# EAGLE schematic us_beacon_base_v3rf (EAGLE 6.5.0)

## Sheet 1 of 6
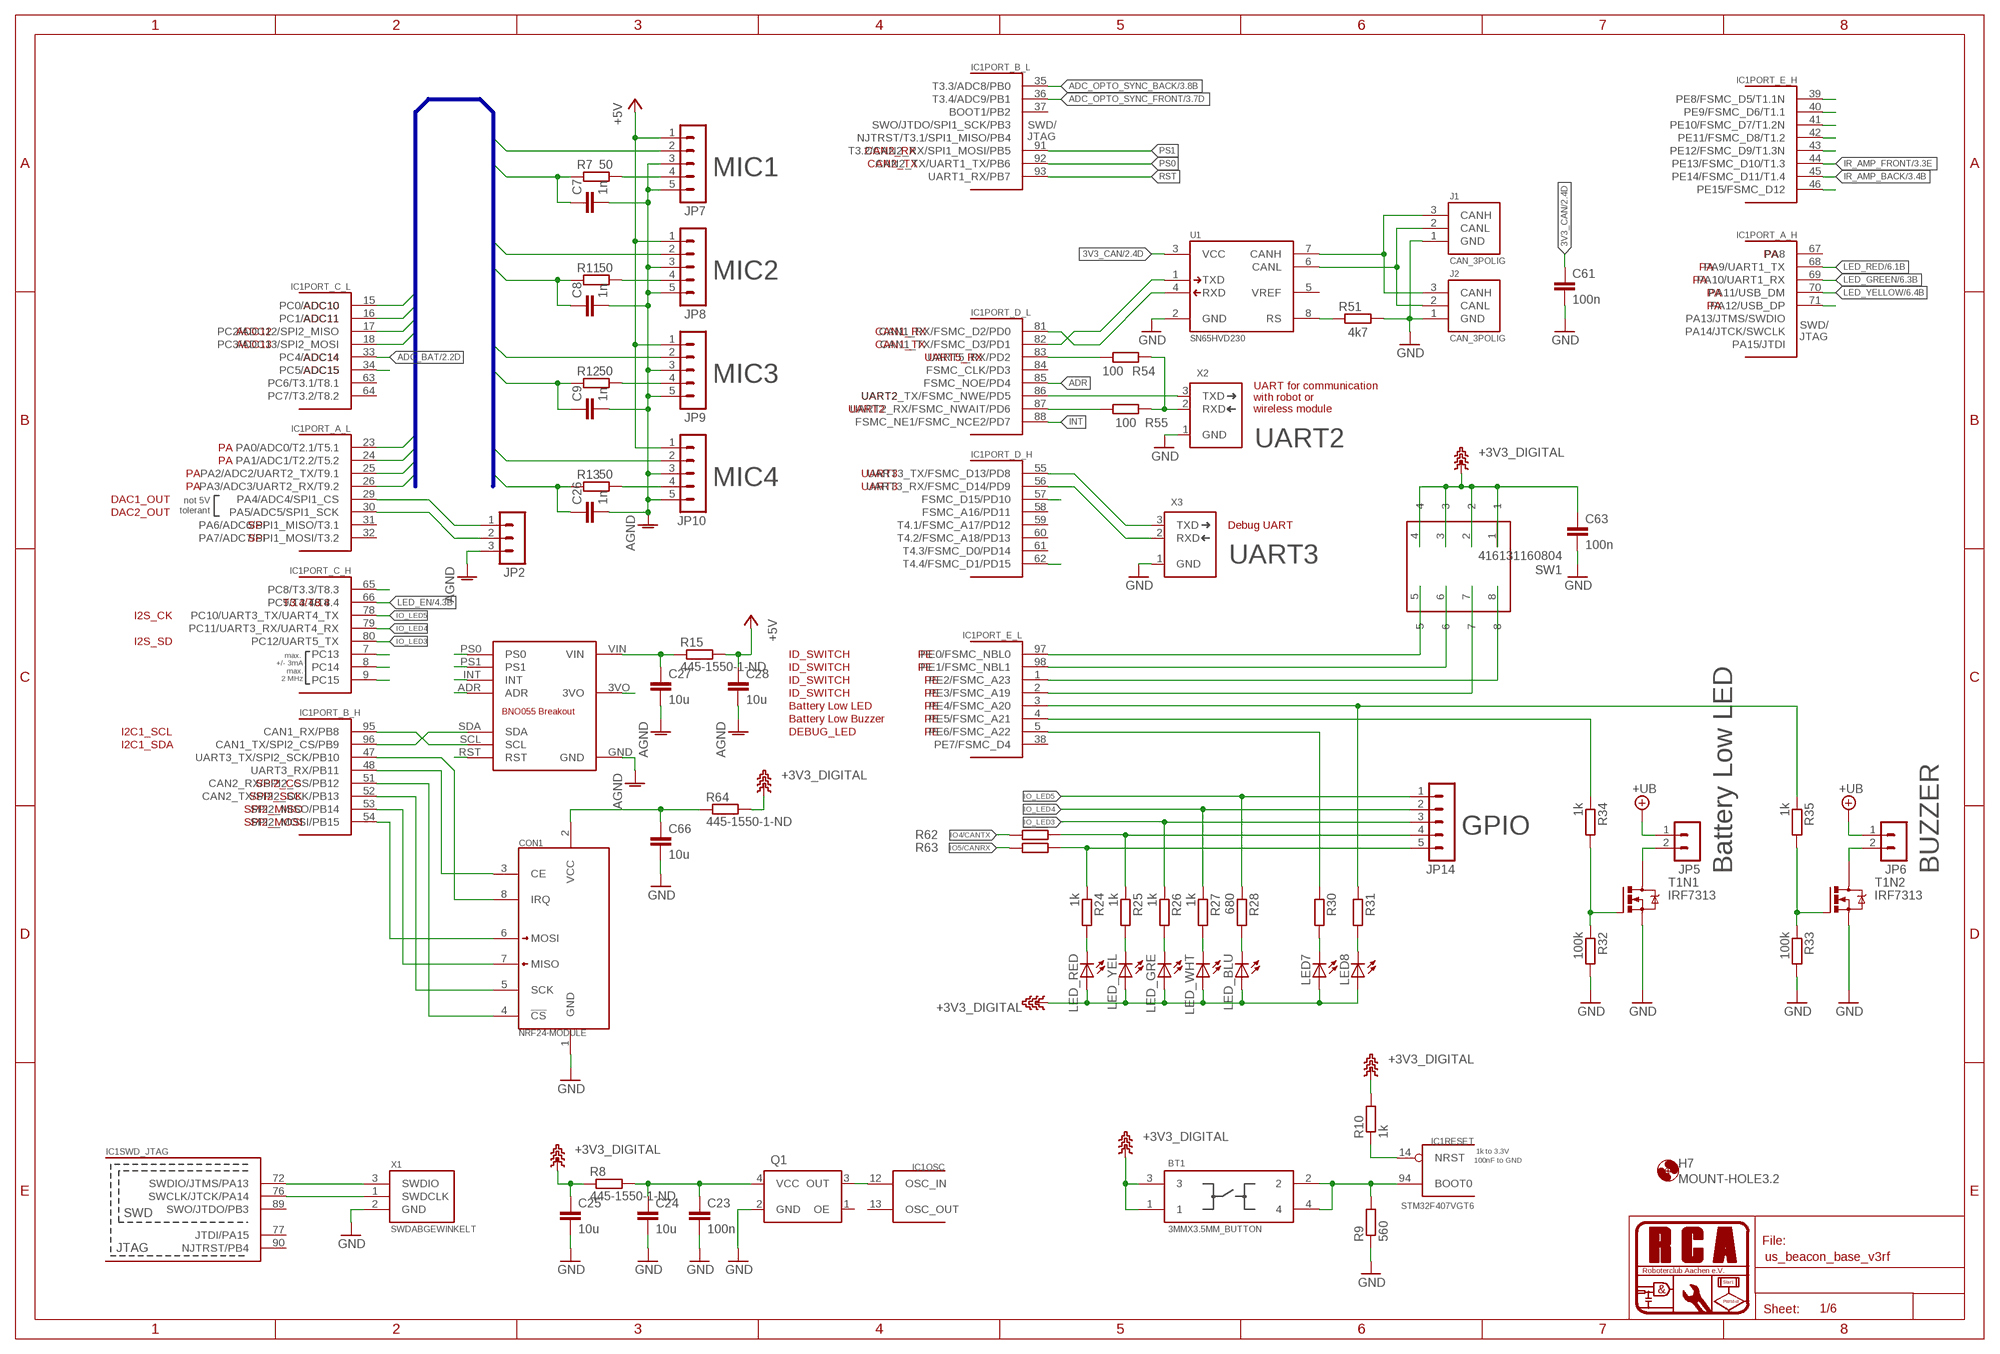
[diagram p0: schematic, sheet 1]

### Parts
BT1  3MMX3.5MM_BUTTON  [3MMX3.5MM_BUTTON]
C7  1n  C-EUC0603  [C0603]
C8  1n  C-EUC0603  [C0603]
C9  1n  C-EUC0603  [C0603]
C23  100n  C-EUC0603  [C0603]
C24  10u  C-EUC0805  [C0805]
C25  10u  C-EUC0805  [C0805]
C26  1n  C-EUC0603  [C0603]
C27  10u  C-EUC0805  [C0805]
C28  10u  C-EUC0805  [C0805]
C61  100n  C-EUC0603  [C0603]
C63  100n  C-EUC0603  [C0603]
C66  10u  C-EUC0805  [C0805]
CON1  NRF24-MODULE  [NRF24-MODULE]
H7  MOUNT-HOLE3.2  [3,2]
IC1  STM32F407VGT6  [TQFP100]
J1  CAN_3POLIG  [7395-03]
J2  CAN_3POLIG  [7395-03]
JP2  PSS_3G  [22-23-2031]
JP5  PSS_2G  [22-23-2021]
JP6  PSS_2G  [22-23-2021]
JP7  PSS_5G  [22-23-2051]
JP8  PSS_5G  [22-23-2051]
JP9  PSS_5G  [22-23-2051]
JP10  PSS_5G  [22-23-2051]
JP14  PSS_5G  [22-23-2051]
LED7  LEDCHIP-LED0603  [CHIP-LED0603]
LED8  LEDCHIP-LED0603  [CHIP-LED0603]
LED_BLU  LEDCHIP-LED0603  [CHIP-LED0603]
LED_GRE  LEDCHIP-LED0603  [CHIP-LED0603]
LED_RED  LEDCHIP-LED0603  [CHIP-LED0603]
LED_WHT  LEDCHIP-LED0603  [CHIP-LED0603]
LED_YEL  LEDCHIP-LED0603  [CHIP-LED0603]
Q1  XO53  [XO53]
R7  50  R-EU_R0603  [R0603]
R8  445-1550-1-ND  R-EU_R0603  [R0603]
R9  560  R-EU_R0603  [R0603]
R10  1k  R-EU_R0603  [R0603]
R11  50  R-EU_R0603  [R0603]
R12  50  R-EU_R0603  [R0603]
R13  50  R-EU_R0603  [R0603]
R15  445-1550-1-ND  R-EU_R0603  [R0603]
R24  1k  R-EU_R0603  [R0603]
R25  1k  R-EU_R0603  [R0603]
R26  1k  R-EU_R0603  [R0603]
R27  1k  R-EU_R0603  [R0603]
R28  680  R-EU_R0603  [R0603]
R30  R-EU_R0603  [R0603]
R31  R-EU_R0603  [R0603]
R32  100k  R-EU_R0603  [R0603]
R33  100k  R-EU_R0603  [R0603]
R34  1k  R-EU_R0603  [R0603]
R35  1k  R-EU_R0603  [R0603]
R51  4k7  R-EU_R0603  [R0603]
R54  100  R-EU_R0603  [R0603]
R55  100  R-EU_R0603  [R0603]
R62  R-EU_R0603  [R0603]
R63  R-EU_R0603  [R0603]
R64  445-1550-1-ND  R-EU_R0603  [R0603]
SW1  416131160804  [416131160804]
T1  IRF7313  IRF7341  [SO08]
U1  SN65HVD230  [SOIC-8]
U$1  BNO055_ADAFRUIT_BREAKOUT  [BNO055_BREAKOUT]
X1  SWDABGEWINKELT  [7395-03]
X2  SERIAL_DEBUG_3PINL  [7395-03]
X3  SERIAL_DEBUG_3PINL  [7395-03]

### Nets
3V3_CAN: C61.1 U1.3(VCC) ; also sheet 2
+3V3_DIGITAL: BT1.1 BT1.3 C25.1 C63.1 LED7.A LED8.A LED_BLU.A LED_GRE.A LED_RED.A LED_WHT.A LED_YEL.A R8.1 R10.2 R64.2 SW1.1 SW1.2 SW1.3 SW1.4 ; also sheet 2
+5V: C28.1 JP7.1 JP8.1 JP9.1 JP10.1 R15.2 ; also sheet 2
+UB: JP5.1 JP6.1 ; also sheet 2,4,6
ADC_BAT: IC1.33(PORT_C_L:PC4/ADC14) ; also sheet 2
ADC_OPTO_SYNC_BACK: IC1.35(PORT_B_L:T3.3/ADC8/PB0) ; also sheet 3
ADC_OPTO_SYNC_FRONT: IC1.36(PORT_B_L:T3.4/ADC9/PB1) ; also sheet 3
ADR: IC1.85(PORT_D_L:FSMC_NOE/PD4) U$1.ADR
AMP1: IC1.23(PORT_A_L:PA0/ADC0/T2.1/T5.1) JP7.2
AMP2: IC1.24(PORT_A_L:PA1/ADC1/T2.2/T5.2) JP8.2
AMP3: IC1.25(PORT_A_L:PA2/ADC2/UART2_TX/T9.1) JP9.2
AMP4: IC1.26(PORT_A_L:PA3/ADC3/UART2_RX/T9.2) JP10.2
DAC1/I2S1_WS: IC1.29(PORT_A_L:PA4/ADC4/SPI1_CS) JP2.1
DAC2/SPI1_SCK: IC1.30(PORT_A_L:PA5/ADC5/SPI1_SCK) JP2.2
GND: C7.2 C8.2 C9.2 C23.2 C24.2 C25.2 C26.2 C27.2 C28.2 C61.2 C63.2 C66.2 CON1.1(GND) J1.1(GND) J2.1(GND) JP2.3 JP7.3 JP7.5 JP8.3 JP8.5 JP9.3 JP9.5 JP10.3 JP10.5 Q1.2(GND) R9.1 R32.2 R33.2 R51.2 T1.1(N1:S) T1.3(N2:S) U1.2(GND) U$1.GND X1.2(GND) X2.1(GND) X3.1(GND) ; supply symbol labelled AGND ; also sheet 2,3,4,6
INT: IC1.88(PORT_D_L:FSMC_NE1/FSMC_NCE2/PD7) U$1.INT
IO4: JP14.4 R25.1 R62.2
IO4/CANTX: IC1.82(PORT_D_L:CAN1_TX/FSMC_D3/PD1) R62.1 U1.1(TXD)
IO5: JP14.5 R24.1 R63.2
IO5/CANRX: IC1.81(PORT_D_L:CAN1_RX/FSMC_D2/PD0) R63.1 U1.4(RXD)
IO_LED3: IC1.80(PORT_C_H:PC12/UART5_TX) JP14.3 R26.1
IO_LED4: IC1.79(PORT_C_H:PC11/UART3_RX/UART4_RX) JP14.2 R27.1
IO_LED5: IC1.78(PORT_C_H:PC10/UART3_TX/UART4_TX) JP14.1 R28.1
IR_AMP_BACK: IC1.45(PORT_E_H:PE14/FSMC_D11/T1.4) ; also sheet 3
IR_AMP_FRONT: IC1.44(PORT_E_H:PE13/FSMC_D10/T1.3) ; also sheet 3
LED_EN: IC1.66(PORT_C_H:PC9/T3.4/T8.4) ; also sheet 4
LED_GREEN: IC1.69(PORT_A_H:PA10/UART1_RX) ; also sheet 6
LED_RED: IC1.68(PORT_A_H:PA9/UART1_TX) ; also sheet 6
LED_YELLOW: IC1.70(PORT_A_H:PA11/USB_DM) ; also sheet 6
MIC1: C7.1 IC1.15(PORT_C_L:PC0/ADC10) R7.1
MIC2: C8.1 IC1.16(PORT_C_L:PC1/ADC11) R11.1
MIC3: C9.1 IC1.17(PORT_C_L:PC2/ADC12/SPI2_MISO) R12.1
MIC4: C26.1 IC1.18(PORT_C_L:PC3/ADC13/SPI2_MOSI) R13.1
N$1: IC1.72(SWD_JTAG:SWDIO/JTMS/PA13) X1.3(SWDIO)
N$2: IC1.76(SWD_JTAG:SWCLK/JTCK/PA14) X1.1(SWDCLK)
N$5: IC1.57(PORT_D_H:FSMC_D15/PD10)
N$13: JP7.4 R7.2
N$15: IC1.12(OSC:OSC_IN) Q1.3(OUT)
N$16: C23.1 C24.1 Q1.4(VCC) R8.2
N$17: JP9.4 R12.2
N$18: IC1.62(PORT_D_H:T4.4/FSMC_D1/PD15)
N$19: IC1.14(RESET:NRST) R10.1
N$20: JP8.4 R11.2
N$21: JP10.4 R13.2
N$22: BT1.2 BT1.4 IC1.94(RESET:BOOT0) R9.2
N$23: IC1.83(PORT_D_L:UART5_RX/PD2) R54.1
N$24: IC1.39(PORT_E_H:PE8/FSMC_D5/T1.1N)
N$25: IC1.65(PORT_C_H:PC8/T3.3/T8.3)
N$29: C27.1 R15.1 U$1.VIN
N$30: U$1.3VO
N$31: R54.2 R55.2 X2.2(RXD)
N$34: IC1.7(PORT_C_H:PC13)
N$35: IC1.8(PORT_C_H:PC14)
N$36: IC1.9(PORT_C_H:PC15)
N$37: IC1.71(PORT_A_H:PA12/USB_DP)
N$46: IC1.46(PORT_E_H:PE15/FSMC_D12)
N$48: IC1.95(PORT_B_H:CAN1_RX/PB8) U$1.SCL
N$49: IC1.96(PORT_B_H:CAN1_TX/SPI2_CS/PB9) U$1.SDA
N$51: IC1.43(PORT_E_H:PE12/FSMC_D9/T1.3N)
N$52: IC1.42(PORT_E_H:PE11/FSMC_D8/T1.2)
N$53: IC1.41(PORT_E_H:PE10/FSMC_D7/T1.2N)
N$54: IC1.40(PORT_E_H:PE9/FSMC_D6/T1.1)
N$64: IC1.86(PORT_D_L:UART2_TX/FSMC_NWE/PD5) X2.3(TXD)
N$65: IC1.87(PORT_D_L:UART2_RX/FSMC_NWAIT/PD6) R55.1
N$66: IC1.55(PORT_D_H:UART3_TX/FSMC_D13/PD8) X3.3(TXD)
N$67: IC1.56(PORT_D_H:UART3_RX/FSMC_D14/PD9) X3.2(RXD)
N$73: LED_RED.C R24.2
N$74: LED_YEL.C R25.2
N$75: LED_GRE.C R26.2
N$76: LED_WHT.C R27.2
N$77: LED_BLU.C R28.2
N$78: LED7.C R30.2
N$79: LED8.C R31.2
N$80: IC1.3(PORT_E_L:PE4/FSMC_A20) R31.1 R35.1
N$82: IC1.5(PORT_E_L:PE6/FSMC_A22) R30.1
N$84: R32.1 R34.2 T1.2(N1:G)
N$85: R33.1 R35.2 T1.4(N2:G)
N$86: JP5.2 T1.7(N1:D)
N$87: IC1.4(PORT_E_L:PE5/FSMC_A21) R34.1
N$89: JP6.2 T1.5(N2:D)
N$90: IC1.2(PORT_E_L:PE3/FSMC_A19) SW1.7
N$92: IC1.34(PORT_C_L:PC5/ADC15)
N$95: IC1.97(PORT_E_L:PE0/FSMC_NBL0) SW1.5
N$96: IC1.98(PORT_E_L:PE1/FSMC_NBL1) SW1.6
N$98: IC1.1(PORT_E_L:PE2/FSMC_A23) SW1.8
N$102: R51.1 U1.8(RS)
N$103: J1.3(CANH) J2.3(CANH) U1.7(CANH)
N$104: J1.2(CANL) J2.2(CANL) U1.6(CANL)
N$116: CON1.4(!CS) IC1.51(PORT_B_H:CAN2_RX/SPI2_CS/PB12)
N$117: CON1.5(SCK) IC1.52(PORT_B_H:CAN2_TX/SPI2_SCK/PB13)
N$118: CON1.7(MISO) IC1.53(PORT_B_H:SPI2_MISO/PB14)
N$119: CON1.6(MOSI) IC1.54(PORT_B_H:SPI2_MOSI/PB15)
N$127: CON1.3(CE) IC1.48(PORT_B_H:UART3_RX/PB11)
N$128: CON1.8(IRQ) IC1.47(PORT_B_H:UART3_TX/SPI2_SCK/PB10)
N$129: C66.1 CON1.2(VCC) R64.1
PS0: IC1.92(PORT_B_L:CAN2_TX/UART1_TX/PB6) U$1.PS0
PS1: IC1.91(PORT_B_L:T3.2/CAN2_RX/SPI1_MOSI/PB5) U$1.PS1
RST: IC1.93(PORT_B_L:UART1_RX/PB7) U$1.RST
Unconnected: IC1.13(OSC:OSC_OUT) IC1.31(PORT_A_L:PA6/ADC6/SPI1_MISO/T3.1) IC1.32(PORT_A_L:PA7/ADC7/SPI1_MOSI/T3.2) IC1.37(PORT_B_L:BOOT1/PB2) IC1.38(PORT_E_L:PE7/FSMC_D4) IC1.58(PORT_D_H:FSMC_A16/PD11) IC1.59(PORT_D_H:T4.1/FSMC_A17/PD12) IC1.60(PORT_D_H:T4.2/FSMC_A18/PD13) IC1.61(PORT_D_H:T4.3/FSMC_D0/PD14) IC1.63(PORT_C_L:PC6/T3.1/T8.1) IC1.64(PORT_C_L:PC7/T3.2/T8.2) IC1.67(PORT_A_H:PA8) IC1.77(SWD_JTAG:JTDI/PA15) IC1.84(PORT_D_L:FSMC_CLK/PD3) IC1.89(SWD_JTAG:SWO/JTDO/PB3) IC1.90(SWD_JTAG:NJTRST/PB4) Q1.1(OE) T1.6(N2:D1) T1.8(N1:D1) U1.5(VREF)

### Buses
ANALOG_MIC:MIC1,MIC2,MIC3,MIC4,AMP1,AMP2,AMP3,AMP4

### Notes on the sheet
- CAN2_RX
- CAN2_TX
- MIC1
- PA
- PA
- MIC2
- PA
- PA
- ADC10 | PA
- ADC11
- ADC12 | CAN1_RX
- ADC13 | CAN1_TX
- ADC14 | UART5_RX
- ADC15
- MIC3
- UART2
- UART2
- UART for communication 
  with robot or 
  wireless module
- UART2
- PA
- PA
- PA | UART3
- MIC4
- PA | UART3
- DAC1_OUT
- DAC2_OUT
- SPI | Debug UART
- SPI
- UART3
- T3.4/T8.4
- I2S_CK
- I2S_SD
- ID_SWITCH | PE
- ID_SWITCH | PE
- ID_SWITCH | PE
- ID_SWITCH | PE
- Battery Low LED | PE
- Battery Low Buzzer | PE
- I2C1_SCL | DEBUG_LED | PE
- I2C1_SDA
- SPI2_CS
- SPI2_SCK
- SPI2_MISO
- SPI2_MOSI
- GPIO
- Battery Low LED | BUZZER

## Sheet 2 of 6
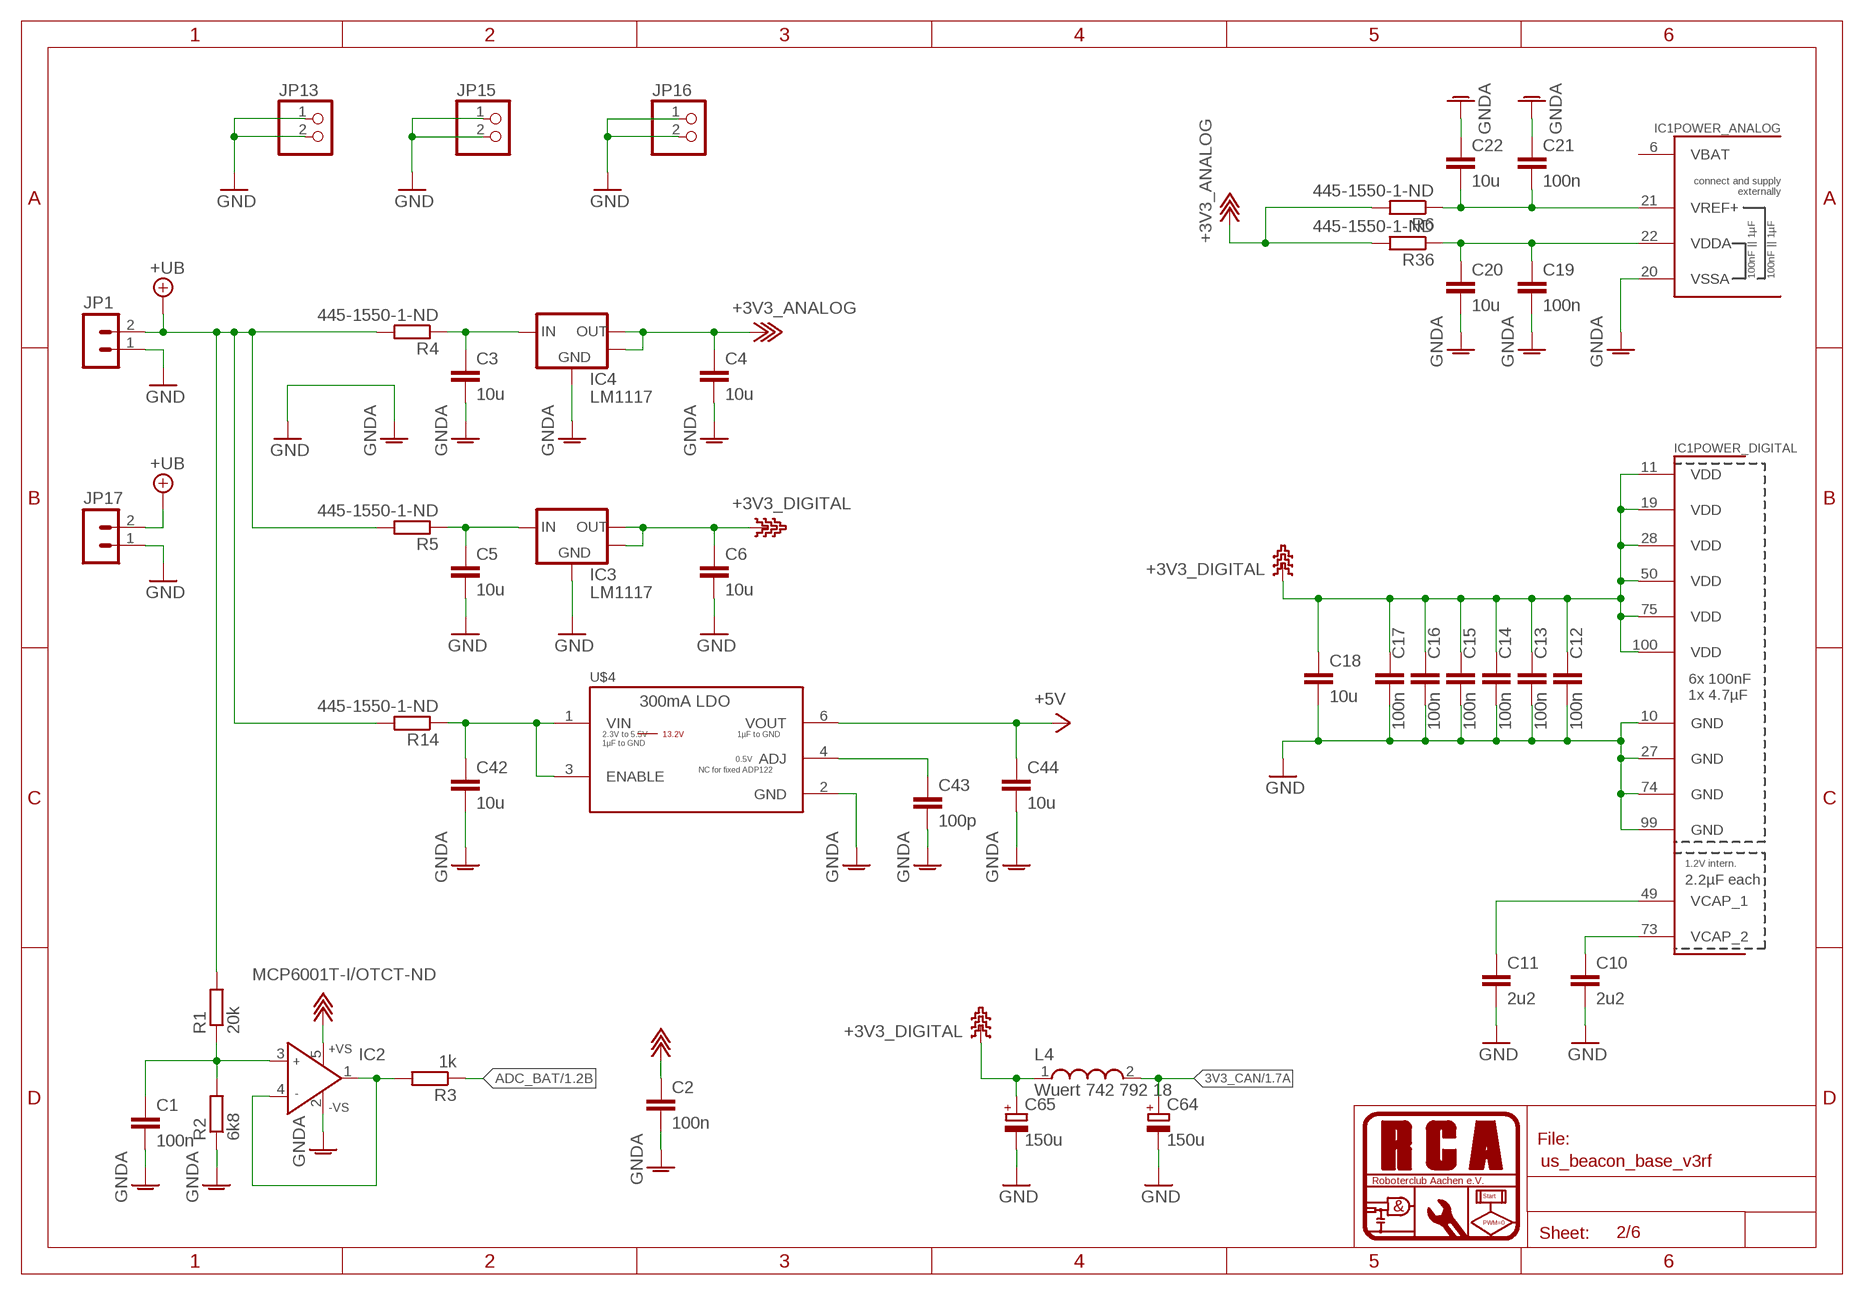
[diagram p1: schematic, sheet 2]

### Parts
C1  100n  C-EUC0603  [C0603]
C2  100n  C-EUC0603  [C0603]
C3  10u  C-EUC0805  [C0805]
C4  10u  C-EUC0805  [C0805]
C5  10u  C-EUC0805  [C0805]
C6  10u  C-EUC0805  [C0805]
C10  2u2  C-EUC0805  [C0805]
C11  2u2  C-EUC0805  [C0805]
C12  100n  C-EUC0603  [C0603]
C13  100n  C-EUC0603  [C0603]
C14  100n  C-EUC0603  [C0603]
C15  100n  C-EUC0603  [C0603]
C16  100n  C-EUC0603  [C0603]
C17  100n  C-EUC0603  [C0603]
C18  10u  C-EUC0805  [C0805]
C19  100n  C-EUC0603  [C0603]
C20  10u  C-EUC0805  [C0805]
C21  100n  C-EUC0603  [C0603]
C22  10u  C-EUC0805  [C0805]
C42  10u  C-EUC0805  [C0805]
C43  100p  C-EUC0603  [C0603]
C44  10u  C-EUC0805  [C0805]
C64  150u  CPOL-EUE3.5-8  [E3,5-8]
C65  150u  CPOL-EUE3.5-8  [E3,5-8]
IC2  MCP6001T-I/OTCT-ND  AD8519RJ  [SOT23-5]
IC3  LM1117  [SOT223]
IC4  LM1117  [SOT223]
JP1  PSS_2G  [22-23-2021]
JP13  PINHD-1X2  [1X02]
JP15  PINHD-1X2  [1X02]
JP16  PINHD-1X2  [1X02]
JP17  PSS_2G  [22-23-2021]
L4  Wuert 742 792 18  WE-CBF_1206(HC)  [WE-CBF_1206(W=5.2)]
R1  20k  R-EU_R0603  [R0603]
R2  6k8  R-EU_R0603  [R0603]
R3  1k  R-EU_R0603  [R0603]
R4  445-1550-1-ND  R-EU_R0603  [R0603]
R5  445-1550-1-ND  R-EU_R0603  [R0603]
R6  445-1550-1-ND  R-EU_R0603  [R0603]
R14  445-1550-1-ND  R-EU_R0603  [R0603]
R36  445-1550-1-ND  R-EU_R0603  [R0603]
U$4  AP2210K-5.0  ADP123  [TSOT23-6]

### Nets
3V3_CAN: C64.+ L4.2 ; also sheet 1
+3V3_ANALOG: C2.1 C4.1 IC2.5(+VS) IC4.2(OUT) IC4.4(OUT) R6.2 R36.2 ; also sheet 3
+3V3_DIGITAL: C6.1 C12.1 C13.1 C14.1 C15.1 C16.1 C17.1 C18.1 C65.+ IC1.11(POWER_DIGITAL:VDD) IC1.19(POWER_DIGITAL:VDD) IC1.28(POWER_DIGITAL:VDD) IC1.50(POWER_DIGITAL:VDD) IC1.75(POWER_DIGITAL:VDD) IC1.100(POWER_DIGITAL:VDD) IC3.2(OUT) IC3.4(OUT) L4.1 ; also sheet 1
+5V: C44.1 U$4.6(VOUT) ; also sheet 1
+UB: JP1.2 JP17.2 R1.2 R4.2 R5.2 R14.2 ; also sheet 1,4,6
ADC_BAT: R3.1 ; also sheet 1
GND: C1.2 C2.2 C3.2 C4.2 C5.2 C6.2 C10.2 C11.2 C12.2 C13.2 C14.2 C15.2 C16.2 C17.2 C18.2 C19.2 C20.2 C21.1 C22.1 C42.2 C43.2 C44.2 C64.- C65.- IC1.10(POWER_DIGITAL:GND) IC1.20(POWER_ANALOG:VSSA) IC1.27(POWER_DIGITAL:GND) IC1.74(POWER_DIGITAL:GND) IC1.99(POWER_DIGITAL:GND) IC2.2(-VS) IC3.1(GND) IC4.1(GND) JP1.1 JP13.1 JP13.2 JP15.1 JP15.2 JP16.1 JP16.2 JP17.1 R2.1 U$4.2(GND) ; supply symbol labelled GNDA ; also sheet 1,3,4,6
N$3: IC2.1(OUT) IC2.4(IN-) R3.2
N$4: C1.1 IC2.3(IN+) R1.1 R2.2
N$6: C42.1 R14.1 U$4.1(VIN) U$4.3(ENABLE)
N$7: C3.1 IC4.3(IN) R4.1
N$8: C10.1 IC1.73(POWER_DIGITAL:VCAP_2)
N$9: C5.1 IC3.3(IN) R5.1
N$11: C11.1 IC1.49(POWER_DIGITAL:VCAP_1)
N$14: C21.2 C22.2 IC1.21(POWER_ANALOG:VREF+) R6.1
N$27: C43.1 U$4.4(ADJ)
N$88: C19.1 C20.1 IC1.22(POWER_ANALOG:VDDA) R36.1

### Notes on the sheet
- 13.2V

## Sheet 3 of 6
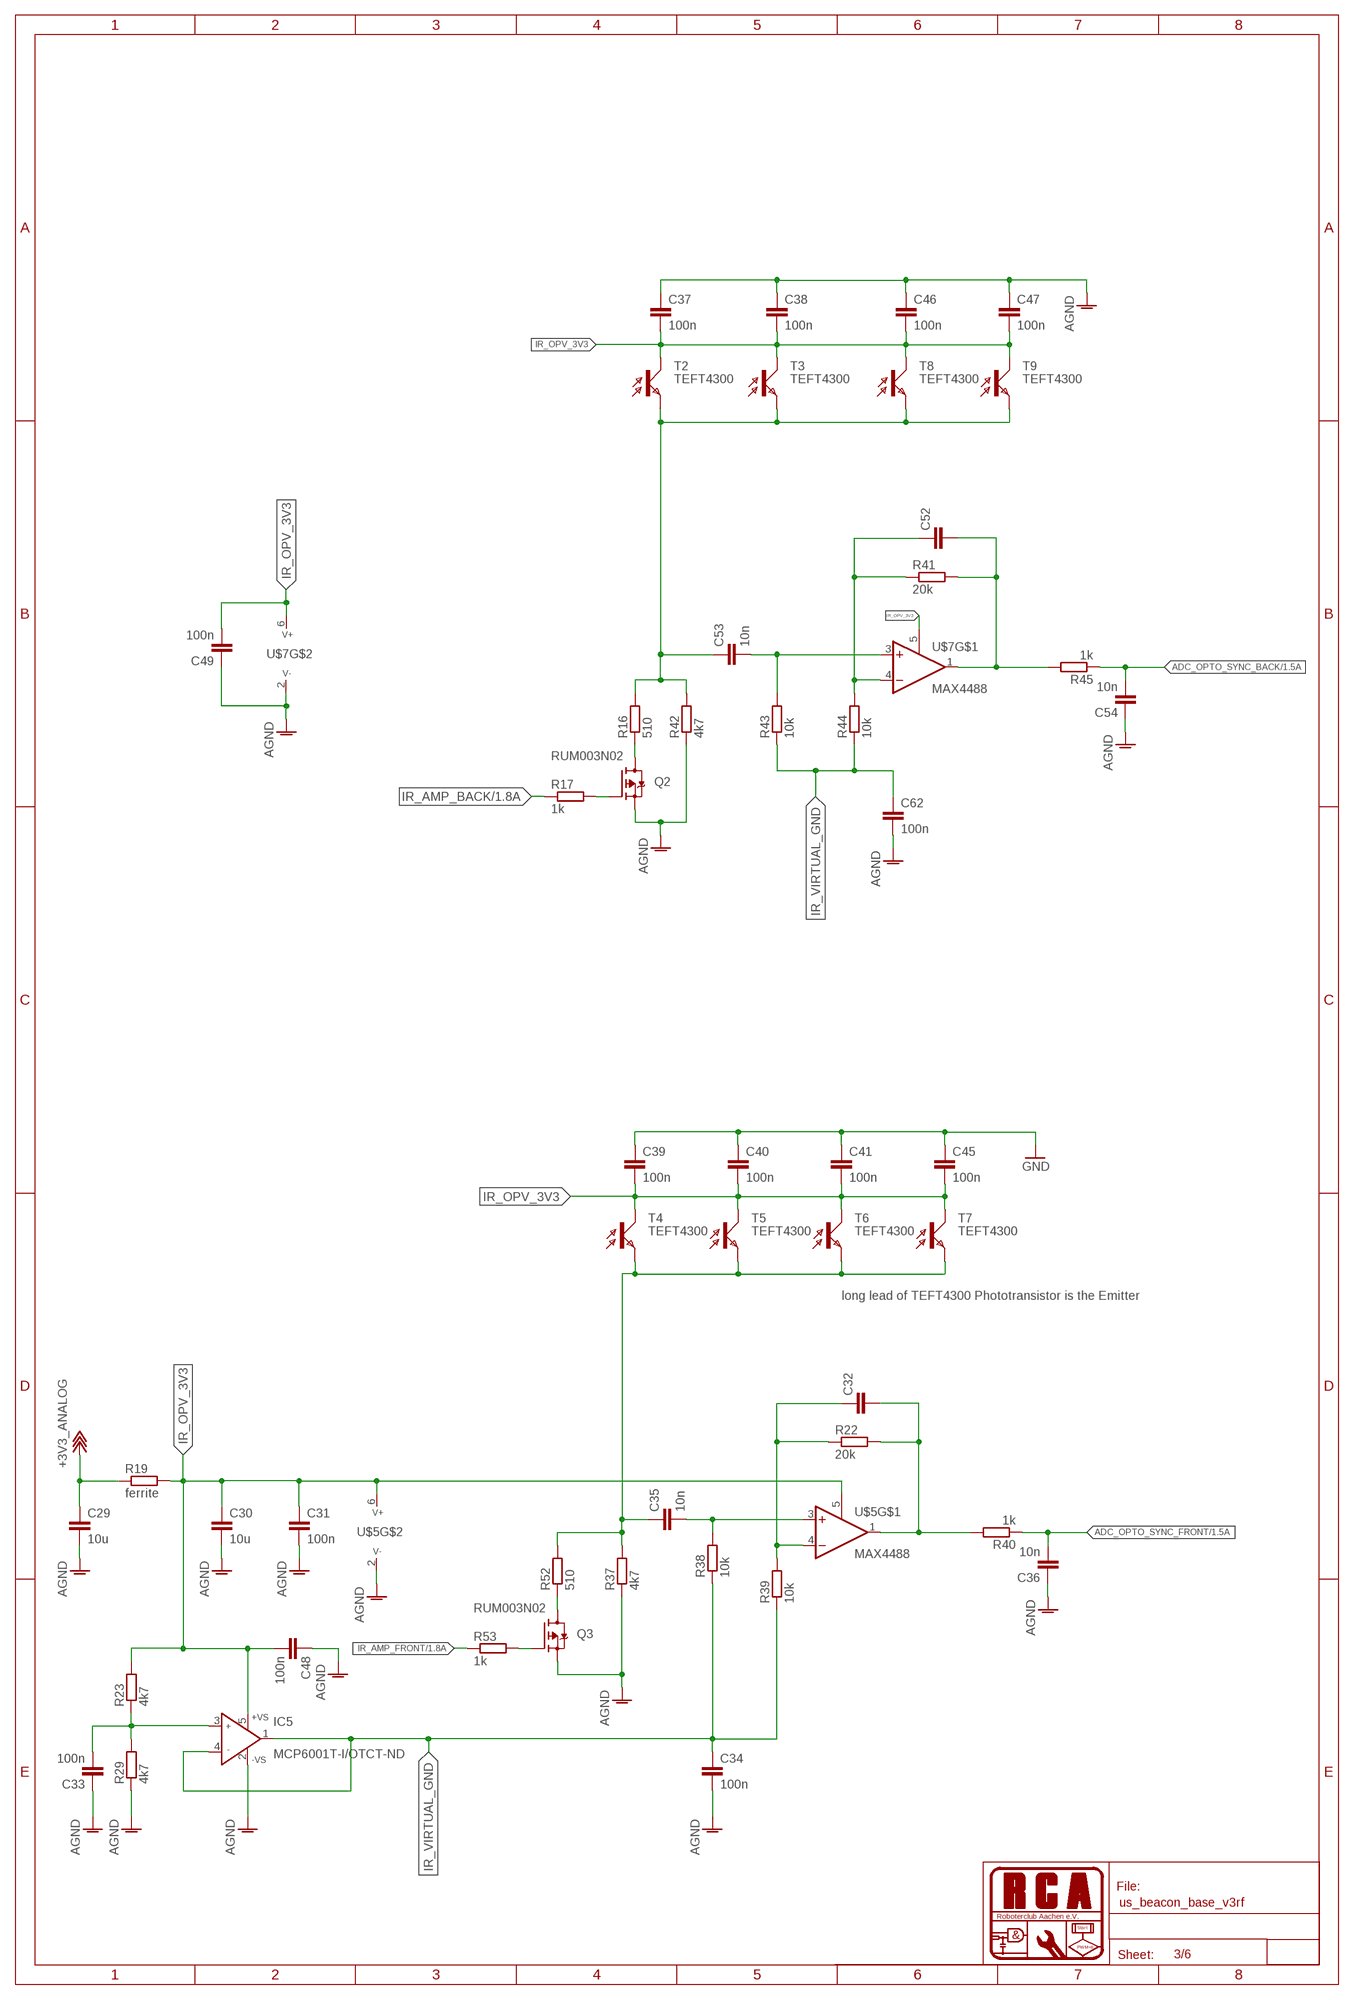
[diagram p2: schematic, sheet 3]

### Parts
C29  10u  C-EUC0805  [C0805]
C30  10u  C-EUC0805  [C0805]
C31  100n  C-EUC0603  [C0603]
C32  C-EUC0603  [C0603]
C33  100n  C-EUC0603  [C0603]
C34  100n  C-EUC0603  [C0603]
C35  10n  C-EUC0603  [C0603]
C36  10n  C-EUC0603  [C0603]
C37  100n  C-EUC0603  [C0603]
C38  100n  C-EUC0603  [C0603]
C39  100n  C-EUC0603  [C0603]
C40  100n  C-EUC0603  [C0603]
C41  100n  C-EUC0603  [C0603]
C45  100n  C-EUC0603  [C0603]
C46  100n  C-EUC0603  [C0603]
C47  100n  C-EUC0603  [C0603]
C48  100n  C-EUC0603  [C0603]
C49  100n  C-EUC0603  [C0603]
C52  C-EUC0603  [C0603]
C53  10n  C-EUC0603  [C0603]
C54  10n  C-EUC0603  [C0603]
C62  100n  C-EUC0603  [C0603]
IC5  MCP6001T-I/OTCT-ND  AD8519RJ  [SOT23-5]
Q2  RUM003N02  BSA223SP  [SC75_INFINEON]
Q3  RUM003N02  BSA223SP  [SC75_INFINEON]
R16  510  R-EU_R0603  [R0603]
R17  1k  R-EU_R0603  [R0603]
R19  ferrite  R-EU_R0603  [R0603]
R22  20k  R-EU_R0603  [R0603]
R23  4k7  R-EU_R0603  [R0603]
R29  4k7  R-EU_R0603  [R0603]
R37  4k7  R-EU_R0603  [R0603]
R38  10k  R-EU_R0603  [R0603]
R39  10k  R-EU_R0603  [R0603]
R40  1k  R-EU_R0603  [R0603]
R41  20k  R-EU_R0603  [R0603]
R42  4k7  R-EU_R0603  [R0603]
R43  10k  R-EU_R0603  [R0603]
R44  10k  R-EU_R0603  [R0603]
R45  1k  R-EU_R0603  [R0603]
R52  510  R-EU_R0603  [R0603]
R53  1k  R-EU_R0603  [R0603]
T2  TEFT4300  LPT80A  [LPT80A]
T3  TEFT4300  LPT80A  [LPT80A]
T4  TEFT4300  LPT80A  [LPT80A]
T5  TEFT4300  LPT80A  [LPT80A]
T6  TEFT4300  LPT80A  [LPT80A]
T7  TEFT4300  LPT80A  [LPT80A]
T8  TEFT4300  LPT80A  [LPT80A]
T9  TEFT4300  LPT80A  [LPT80A]
U$5  MAX4488  [TSOT23-6]
U$7  MAX4488  [TSOT23-6]

### Nets
+3V3_ANALOG: C29.1 R19.1 ; also sheet 2
ADC_OPTO_SYNC_BACK: C54.2 R45.1 ; also sheet 1
ADC_OPTO_SYNC_FRONT: C36.2 R40.1 ; also sheet 1
GND: C29.2 C30.2 C31.2 C33.1 C34.2 C36.1 C37.1 C38.1 C39.1 C40.1 C41.1 C45.1 C46.1 C47.1 C48.1 C49.1 C54.1 C62.2 IC5.2(-VS) Q2.3(S) Q3.3(S) R29.1 R37.1 R42.1 U$5.2(V-) U$7.2(V-) ; supply symbol labelled AGND ; also sheet 1,2,4,6
IR_AMP_BACK: R17.1 ; also sheet 1
IR_AMP_FRONT: R53.1 ; also sheet 1
IR_OPV_3V3: C30.1 C31.1 C37.2 C38.2 C39.2 C40.2 C41.2 C45.2 C46.2 C47.2 C48.2 C49.2 IC5.5(+VS) R19.2 R23.2 T2.C T3.C T4.C T5.C T6.C T7.C T8.C T9.C U$5.5(EN) U$5.6(V+) U$7.5(EN) U$7.6(V+)
IR_VIRTUAL_GND: C34.1 C62.1 IC5.1(OUT) IC5.4(IN-) R38.1 R39.1 R43.1 R44.1
N$10: Q2.2(D) R16.1
N$12: Q2.1(G) R17.2
N$38: C53.1 R16.2 R42.2 T2.E T3.E T8.E T9.E
N$39: C35.2 R38.2 U$5.3(+IN)
N$40: Q3.2(D) R52.1
N$41: C32.2 R22.2 R40.2 U$5.1(OUT)
N$42: C32.1 R22.1 R39.2 U$5.4(-IN)
N$44: Q3.1(G) R53.2
N$45: C33.2 IC5.3(IN+) R23.1 R29.2
N$57: C52.2 R41.2 R45.2 U$7.1(OUT)
N$58: C52.1 R41.1 R44.2 U$7.4(-IN)
N$60: C35.1 R37.2 R52.2 T4.E T5.E T6.E T7.E
N$61: C53.2 R43.2 U$7.3(+IN)

### Notes on the sheet
- long lead of TEFT4300 Phototransistor is the Emitter

## Sheet 4 of 6
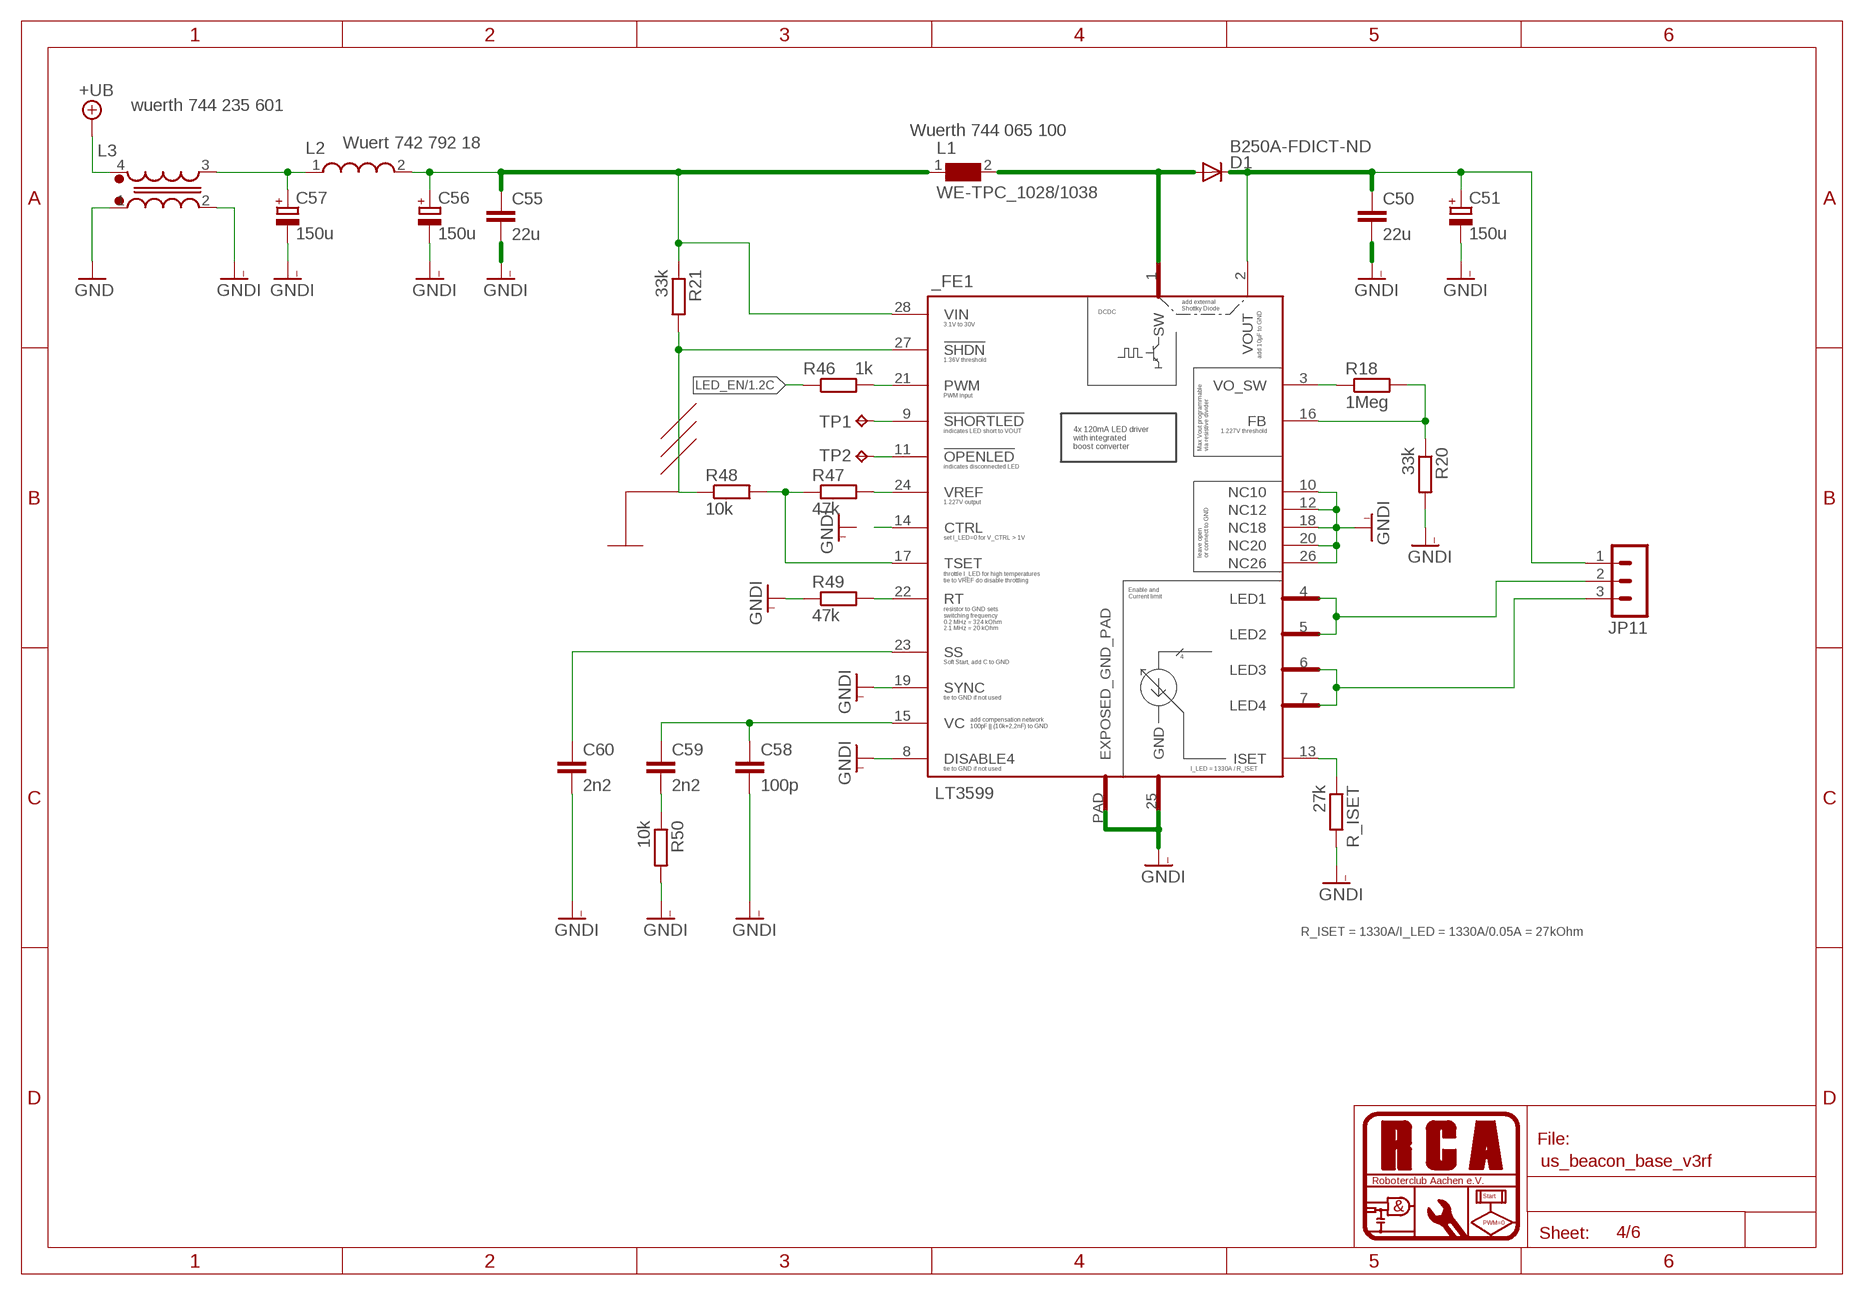
[diagram p3: schematic, sheet 4]

### Parts
_FE1  LT3599  [TSSOP28]
C50  22u  C-EUC1206  [C1206]
C51  150u  CPOL-EUE3.5-8  [E3,5-8]
C55  22u  C-EUC1206  [C1206]
C56  150u  CPOL-EUE3.5-8  [E3,5-8]
C57  150u  CPOL-EUE3.5-8  [E3,5-8]
C58  100p  C-EUC0603  [C0603]
C59  2n2  C-EUC0603  [C0603]
C60  2n2  C-EUC0603  [C0603]
D1  B250A-FDICT-ND  DIODE-SMB  [SMB]
JP11  PSS_3G  [22-23-2031]
L1  WE-TPC_1028/1038  [WE-TPC_1028/1038]
L2  Wuert 742 792 18  WE-CBF_1206(HC)  [WE-CBF_1206(W=5.2)]
L3  wuerth 744 235 601  WE-CNSW_1812  [WE-CNSW_1812]
R18  1Meg  R-EU_R0603  [R0603]
R20  33k  R-EU_R0603  [R0603]
R21  33k  R-EU_R0603  [R0603]
R46  1k  R-EU_R0603  [R0603]
R47  47k  R-EU_R0603  [R0603]
R48  10k  R-EU_R0603  [R0603]
R49  47k  R-EU_R0603  [R0603]
R50  10k  R-EU_R0603  [R0603]
R_ISET  27k  R-EU_R0603  [R0603]
TP1  TPTP06R  [TP06R]
TP2  TPTP06R  [TP06R]

### Nets
+UB: L3.4 ; also sheet 1,2,6
DCDC_SW_NODE: _FE1.1(SW) D1.A L1.2
GND: L3.1 ; also sheet 1,2,3,6
GNDI: _FE1.8(DISABLE4) _FE1.10(NC10) _FE1.12(NC12) _FE1.18(NC18) _FE1.19(SYNC) _FE1.20(NC20) _FE1.25(GND) _FE1.26(NC26) _FE1.PAD(EXPOSED_GND_PAD) C50.2 C51.- C55.2 C56.- C57.- C58.2 C60.2 L3.2 R20.2 R49.1 R50.2 R_ISET.2
LED_EN: R46.1 ; also sheet 1
N$33: _FE1.21(PWM) R46.2
N$43: C57.+ L2.1 L3.3
N$55: _FE1.15(VC) C58.1 C59.1
N$56: _FE1.2(VOUT) C50.1 C51.+ D1.C JP11.1
N$59: _FE1.4(LED1) _FE1.5(LED2) JP11.2
N$62: _FE1.6(LED3) _FE1.7(LED4) JP11.3
N$69: _FE1.16(FB) R18.2 R20.1
N$70: _FE1.3(VO_SW) R18.1
N$71: _FE1.9(!SHORTLED) TP1.TP
N$72: _FE1.11(!OPENLED) TP2.TP
N$81: _FE1.17(TSET) R47.1 R48.2
N$83: _FE1.24(VREF) R47.2
N$91: _FE1.27(!SHDN) R21.2 R48.1
N$94: _FE1.28(VIN) C55.1 C56.+ L1.1 L2.2 R21.1
N$97: _FE1.22(RT) R49.2
N$99: _FE1.23(SS) C60.1
N$100: C59.2 R50.1
N$101: _FE1.13(ISET) R_ISET.1
N$130: _FE1.14(CTRL)

### Notes on the sheet
- Wuerth 744 065 100
- R_ISET = 1330A/I_LED = 1330A/0.05A = 27kOhm

## Sheet 5 of 6
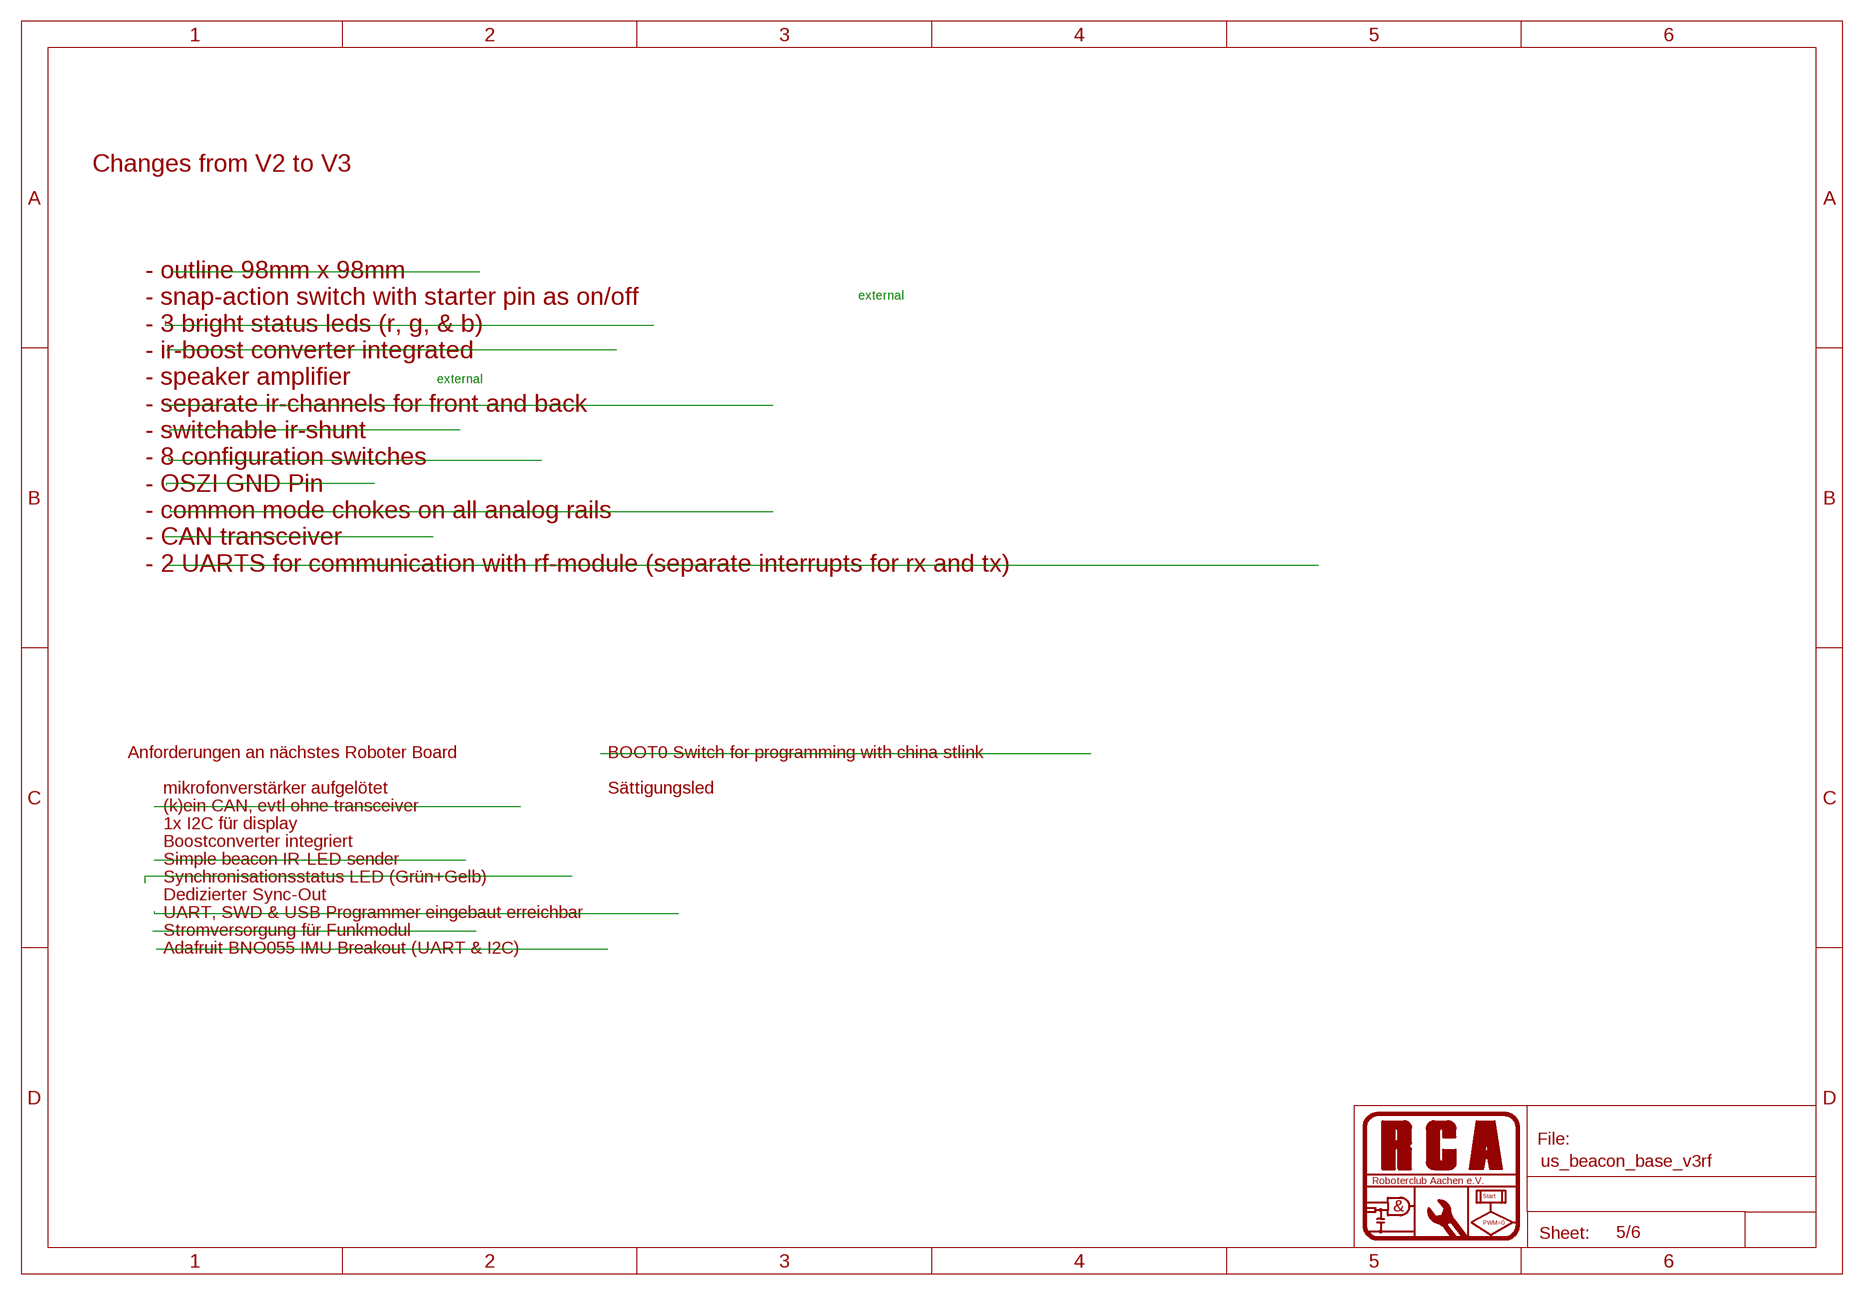
[diagram p4: schematic, sheet 5]

### Notes on the sheet
- Changes from V2 to V3
- - outline 98mm x 98mm
  - snap-action switch with starter pin as on/off
  - 3 bright status leds (r, g, & b)
  - ir-boost converter integrated
  - speaker amplifier 
  - separate ir-channels for front and back
  - switchable ir-shunt
  - 8 configuration switches
  - OSZI GND Pin
  - common mode chokes on all analog rails
  - CAN transceiver
  - 2 UARTS for communication with rf-module (separate interrupts for rx and tx)
- external
- external
- Anforderungen an nächstes Roboter Board | BOOT0 Switch for programming with china stlink
- mikrofonverstärker aufgelötet | Sättigungsled
- (k)ein CAN, evtl ohne transceiver
- 1x I2C für display
- Boostconverter integriert
- Simple beacon IR-LED sender
- Synchronisationsstatus LED (Grün+Gelb)
- Dedizierter Sync-Out
- UART, SWD & USB Programmer eingebaut erreichbar
- Stromversorgung für Funkmodul
- Adafruit BNO055 IMU Breakout (UART & I2C)

## Sheet 6 of 6
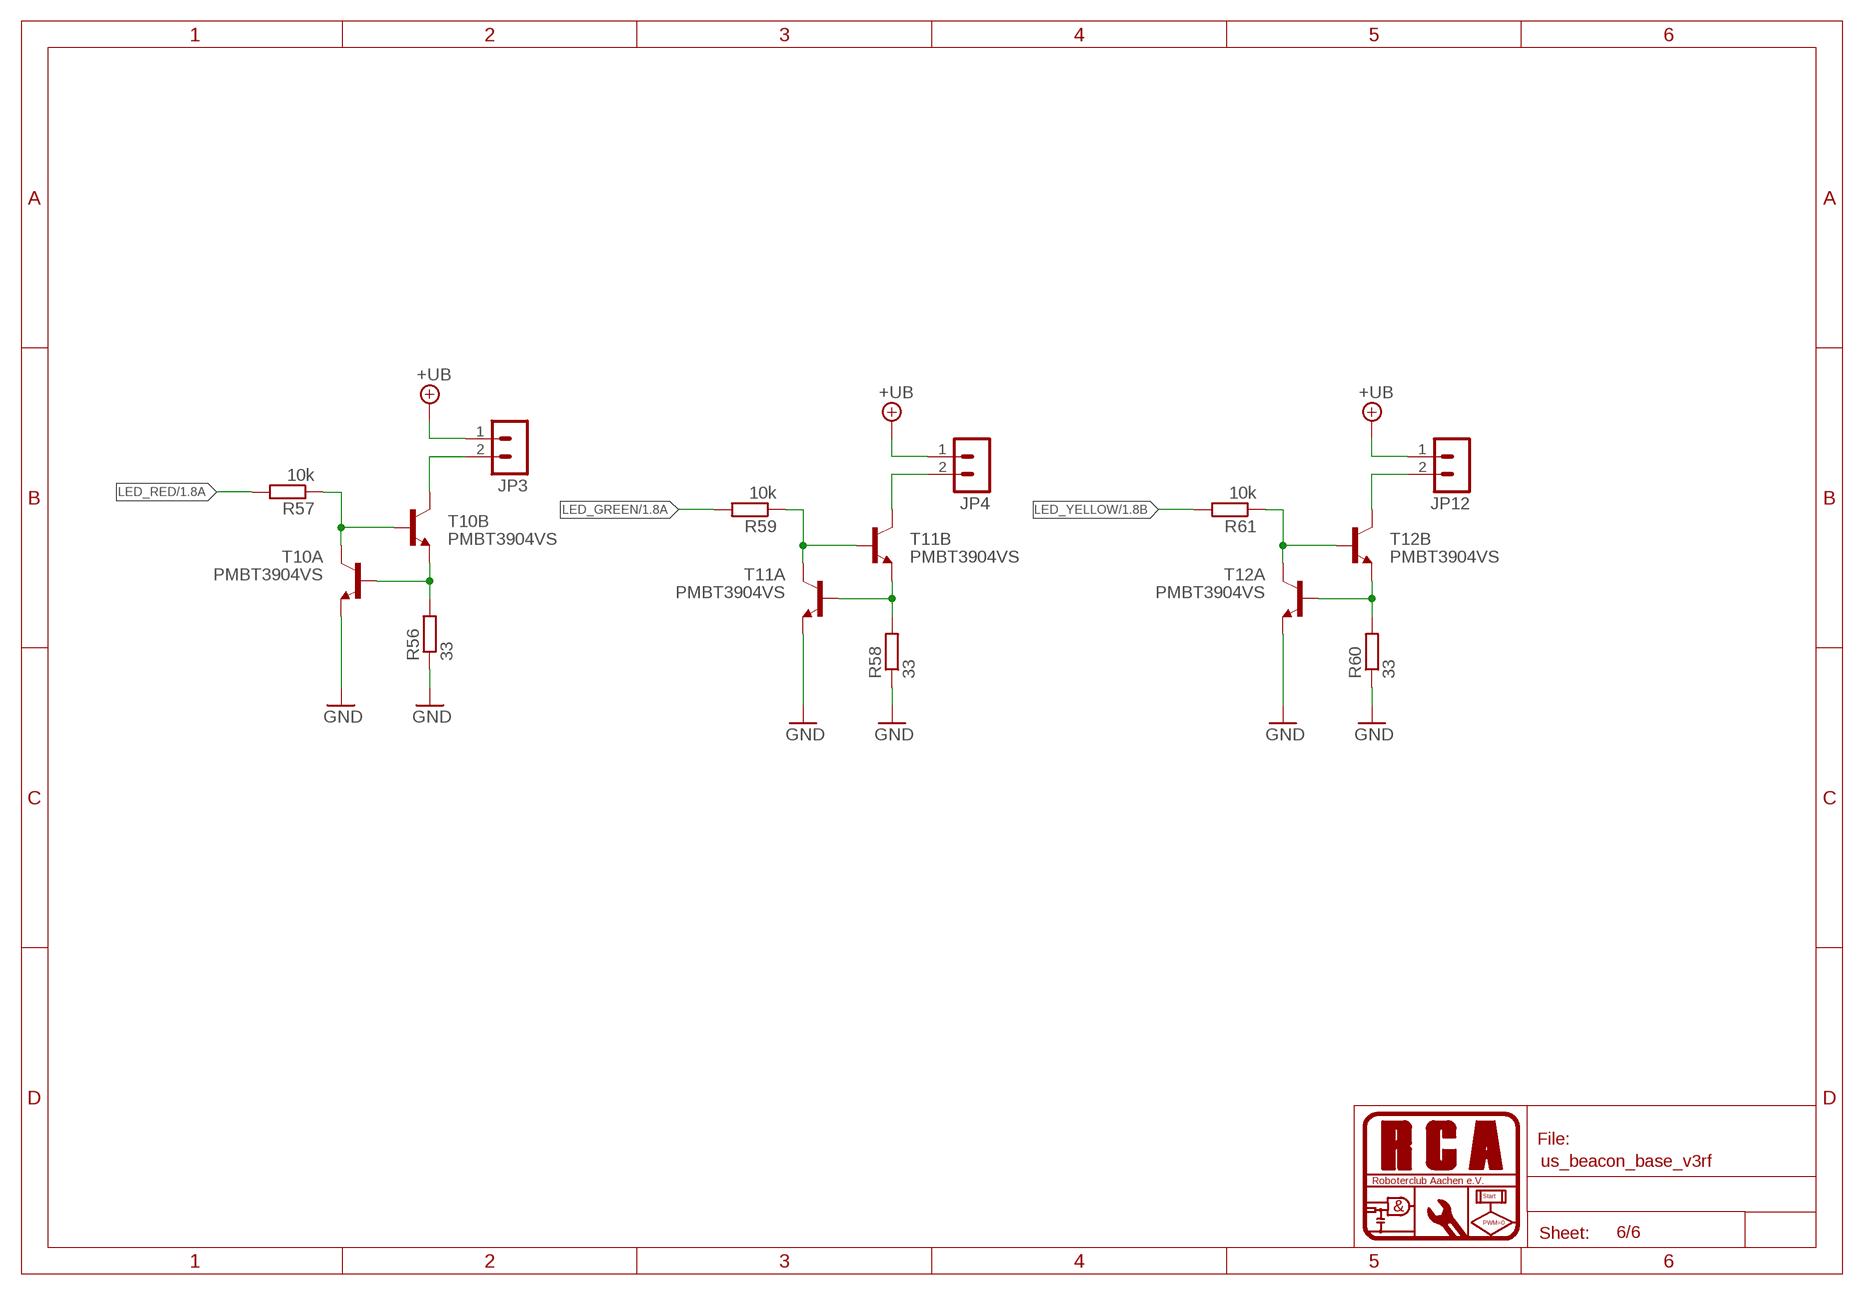
[diagram p5: schematic, sheet 6]

### Parts
JP3  PSS_2G  [22-23-2021]
JP4  PSS_2G  [22-23-2021]
JP12  PSS_2G  [22-23-2021]
R56  33  R-EU_R0603  [R0603]
R57  10k  R-EU_R0603  [R0603]
R58  33  R-EU_R0603  [R0603]
R59  10k  R-EU_R0603  [R0603]
R60  33  R-EU_R0603  [R0603]
R61  10k  R-EU_R0603  [R0603]
T10  PMBT3904VS  CMLT5088E  [SOT563]
T11  PMBT3904VS  CMLT5088E  [SOT563]
T12  PMBT3904VS  CMLT5088E  [SOT563]

### Nets
+UB: JP3.1 JP4.1 JP12.1 ; also sheet 1,2,4
GND: R56.1 R58.1 R60.1 T10.1(A:E) T11.1(A:E) T12.1(A:E) ; also sheet 1,2,3,4
LED_GREEN: R59.2 ; also sheet 1
LED_RED: R57.2 ; also sheet 1
LED_YELLOW: R61.2 ; also sheet 1
N$32: R56.2 T10.2(A:B) T10.4(B:E)
N$50: R57.1 T10.5(B:B) T10.6(A:C)
N$68: JP3.2 T10.3(B:C)
N$109: R58.2 T11.2(A:B) T11.4(B:E)
N$110: R59.1 T11.5(B:B) T11.6(A:C)
N$111: JP4.2 T11.3(B:C)
N$113: R60.2 T12.2(A:B) T12.4(B:E)
N$114: R61.1 T12.5(B:B) T12.6(A:C)
N$115: JP12.2 T12.3(B:C)

## Power pins joined to a net without a drawn wire
VBAT: IC1.6(POWER_ANALOG:VBAT)

## Library data of the parts
_FE1 = Bosch_Adafruit_BNO055:LT3599
BT1 = rca_sontiges:3MMX3.5MM_BUTTON
C1-C50 C52-C55 C58-C63 C66 = resistor:C-EU: CAPACITOR, European symbol
C51 C56 C57 C64 C65 = resistor:CPOL-EU: POLARIZED CAPACITOR, European symbol
CON1 = rca_sontiges:NRF24-MODULE: NRF24L01+ 2.4GHz wireless module
D1 = diode:DIODE-: DIODE
H7 = holes:MOUNT-HOLE: MOUNTING HOLE with drill center marker
IC1 = stm32:STM32F407VGT6: STM32F407VGT6 100 pin LQFP
IC2 IC5 = analog-devices:AD8519: 8 MHz Rail-to-Rail Operational Amplifiers Source: http://www.analog.com/static/imported-files/data_sheets/AD8519_8529.pdf; MF: ALTERA CORPORATION; MPN: AD8519ARTZ-REEL7; OC_FARNELL: 1464960; OC_NEWARK: 59K6794
IC3 IC4 = rca_spgversorgung:LM1117: LM1117 800mA Low-Dropout Linear Regulator
J1 J2 = rca_stecker:CAN_3POLIG
JP1 JP3-JP6 JP12 JP17 = rca_stecker:PSS_2
JP2 JP11 = rca_stecker:PSS_3
JP7-JP10 JP14 = rca_stecker:PSS_5
JP13 JP15 JP16 = rca_pinhead:PINHD-1X2: PIN HEADER
L1 = Wuerth_Elektronik_eiSos_V6:WE-TPC: Shielded Tiny Power Inductor WE-TPC - Extremely flat power inductor - High current capability - High reliability and perfect soldering characteristics because of integrated soldering pad - magnetically shielded -- Portable power like PDA, digital camera, PCMICA-cards and displays -- DC/DC-converter -- Recommended for switching regulator IC's from Linear Technology, National Semiconductor, Texas Instruments and Fairchild Semiconductor
L2 L4 = Wurth_Elektronik_Passive_rev15b:WE-CBF: WE-CBF SMD EMI Suppression Ferrite Bead Characteristics Reliable Ni-Sn electrodes High rated current up to 6 A Operating temperature: –55 ºC to +125 ºC Applications Perfect as data lined filter and for uncoupling of distribution voltage Variant abbreviation WB means WIDE BAND HS means HIGH SPEED HC means HIGH CURRENT <http://katalog.we-online.de/media/images/eisos/FeCBF_pf2.jpg> Details see: http://katalog.we-online.de/en/pbs/WE-CBF Updated on 2014-06-19 2014 (C) Wurth Elektronik
L3 = Wurth_Elektronik_Passive_rev15b:WE-CNSW: WE-CNSW SMD Common Mode Line Filter Characteristics High common mode noise suppression at high frequencies Small influence on high speed signals through winding symmetry Operating temperature: –40 ºC to +125 ºC (Size 0805/1206/1812); –40 ºC to +105 ºC (Size 0603) Applications USB 2.0 IEEE 1394 (Firewire) LVDS High Speed Data Lines LAN <http://katalog.we-online.de/media/images/eisos/IndCNSW_pf2.jpg> Details see: http://katalog.we-online.de/en/pbs/WE-CNSW Updated by Dan Xu 2014-06-30 2014 (C) Wurth Elektronik
LED7 LED8 LED_BLU LED_GRE LED_RED LED_WHT LED_YEL = led:LED: LED OSRAM: - CHIPLED LG R971, LG N971, LY N971, LG Q971, LY Q971, LO R971, LY R971 LH N974, LH R974 LS Q976, LO Q976, LY Q976 LO Q996 - Hyper CHIPLED LW Q18S LB Q993, LB Q99A, LB R99A - SideLED LS A670, LO A670, LY A670, LG A670, LP A670 LB A673, LV A673, LT A673, LW A673 LH A674 LY A675 LS A676, LA A676, LO A676, LY A676, LW A676 LS A679, LY A679, LG A679 - Hyper Micro SIDELED® LS Y876, LA Y876, LO Y876, LY Y876 LT Y87S - SmartLED LW L88C, LW L88S LB L89C, LB L89S, LG L890 LS L89K, LO L89K, LY L89K LS L896, LA L896, LO L896, LY L896 - TOPLED LS T670, LO T670, LY T670, LG T670, LP T670 LSG T670, LSP T670, LSY T670, LOP T670, LYG T670 LG T671, LOG T671, LSG T671 LB T673, LV T673, LT T673, LW T673 LH T674 LS T676, LA T676, LO T676, LY T676, LB T676, LH T676, LSB T676, LW T676 LB T67C, LV T67C, LT T67C, LS T67K, LO T67K, LY T67K, LW E67C LS E67B, LA E67B, LO E67B, LY E67B, LB E67C, LV E67C, LT E67C LW T67C LS T679, LY T679, LG T679 LS T770, LO T770, LY T770, LG T770, LP T770 LB T773, LV T773, LT T773, LW T773 LH T774 LS E675, LA E675, LY E675, LS T675 LS T776, LA T776, LO T776, LY T776, LB T776 LHGB T686 LT T68C, LB T68C - Hyper Mini TOPLED® LB M676 - Mini TOPLED Santana® LG M470 LS M47K, LO M47K, LY M47K Source: http://www.osram.convergy.de LUXEON: - LUMILED® LXK2-PW12-R00, LXK2-PW12-S00, LXK2-PW14-U00, LXK2-PW14-V00 LXK2-PM12-R00, LXK2-PM12-S00, LXK2-PM14-U00 LXK2-PE12-Q00, LXK2-PE12-R00, LXK2-PE12-S00, LXK2-PE14-T00, LXK2-PE14-U00 LXK2-PB12-K00, LXK2-PB12-L00, LXK2-PB12-M00, LXK2-PB14-N00, LXK2-PB14-P00, LXK2-PB14-Q00 LXK2-PR12-L00, LXK2-PR12-M00, LXK2-PR14-Q00, LXK2-PR14-R00 LXK2-PD12-Q00, LXK2-PD12-R00, LXK2-PD12-S00 LXK2-PH12-R00, LXK2-PH12-S00 LXK2-PL12-P00, LXK2-PL12-Q00, LXK2-PL12-R00 Source: www.luxeon.com KINGBRIGHT: KA-3528ASYC Source: www.kingbright.com
Q1 = rca_clock:XO: XO91 Series Oscillators Frequency Range 500 kHz to 125 MHz Supply voltage range 1.8, 2.5, 3.3 or 5.0 Volts Gibt es in der 3,3V Version bei Reichelt (XO91 #Wert) Datenblatt: http://www.reichelt.de/?;ACTION=7;LA=6;OPEN=0;INDEX=0;FILENAME=B400%252FXO91.pdf XO53 Series Oscillators Frequency Range 2.5 MHz to 125 MHz Supply voltage range 1.8, 2.5, 3.3 Volts Gibt es in der 3,3V Version bei Reichelt (XO53 #Wert) XO32 Series Oscillators Frequency Range 8 MHz to 50 MHz Supply voltage range 1.8, 2.5, 3.3 Volts Gibt es in der 3,3V Version bei Reichelt (XO32 #Wert)
Q2 Q3 = transistor-fet:BSA223SP: OptiMOS(R)-P Small-Signal-Transistor P-Channel, Enhancement mode, Super Logic Level (2.5 V rated) Source: http://www.infineon.com/upload/Document/BSA223SP_Rev1.3.pdf
R1-R64 R_ISET = resistor:R-EU_: RESISTOR, European symbol
SW1 = Eagle_Wuerth_Elektronik_Switch:416131160804: WS-HP-1.27 mm small compact SMD Dip Switch with top tape,8 pins,4 poles
T1 = rca_mosfet:IRF7341: IRF7341 Dual N-Channel Mosfet HEXFET® Power MOSFET Generation V Technology Ultra Low On-Resistance Surface Mount Available in Tape & Reel Dynamic dv/dt Rating Fast Switching RDS(on) = 0.050 Ohm VDSS = 55 V
T2-T9 = opto-trans-siemens:LPT80A: PHOTO TRANSISTOR; OC_FARNELL: unknown; OC_NEWARK: unknown
T10-T12 = Bosch_Adafruit_BNO055:CMLT5088E: DUAL NPN/NPN L88 TRANSISTORS ENHANCED SPECIFICATION PICOmini(TM) SURFACE MOUNT Source: CMLT5078%20SERIES.pdf
TP1 TP2 = testpad:TP: Test pad
U1 = rca_ic:SN65HVD230: 3.3V CAN Transceiver mit Split-Terminierung und Slope-Control
U$1 = Bosch_Adafruit_BNO055:BNO055_ADAFRUIT_BREAKOUT
U$4 = rca_ic:ADP123
U$5 U$7 = saw:MAX4488
X1 = rca_stecker:SWD: SWD Programmierstecker SWD-Interface aus SWDIO+SWDCLK+GND für die Verwendung mit STLinkV2, andere Programmer benötigen möglicherweise auch VCC oder Reset
X2 X3 = rca_stecker:SERIAL_DEBUG_3PIN